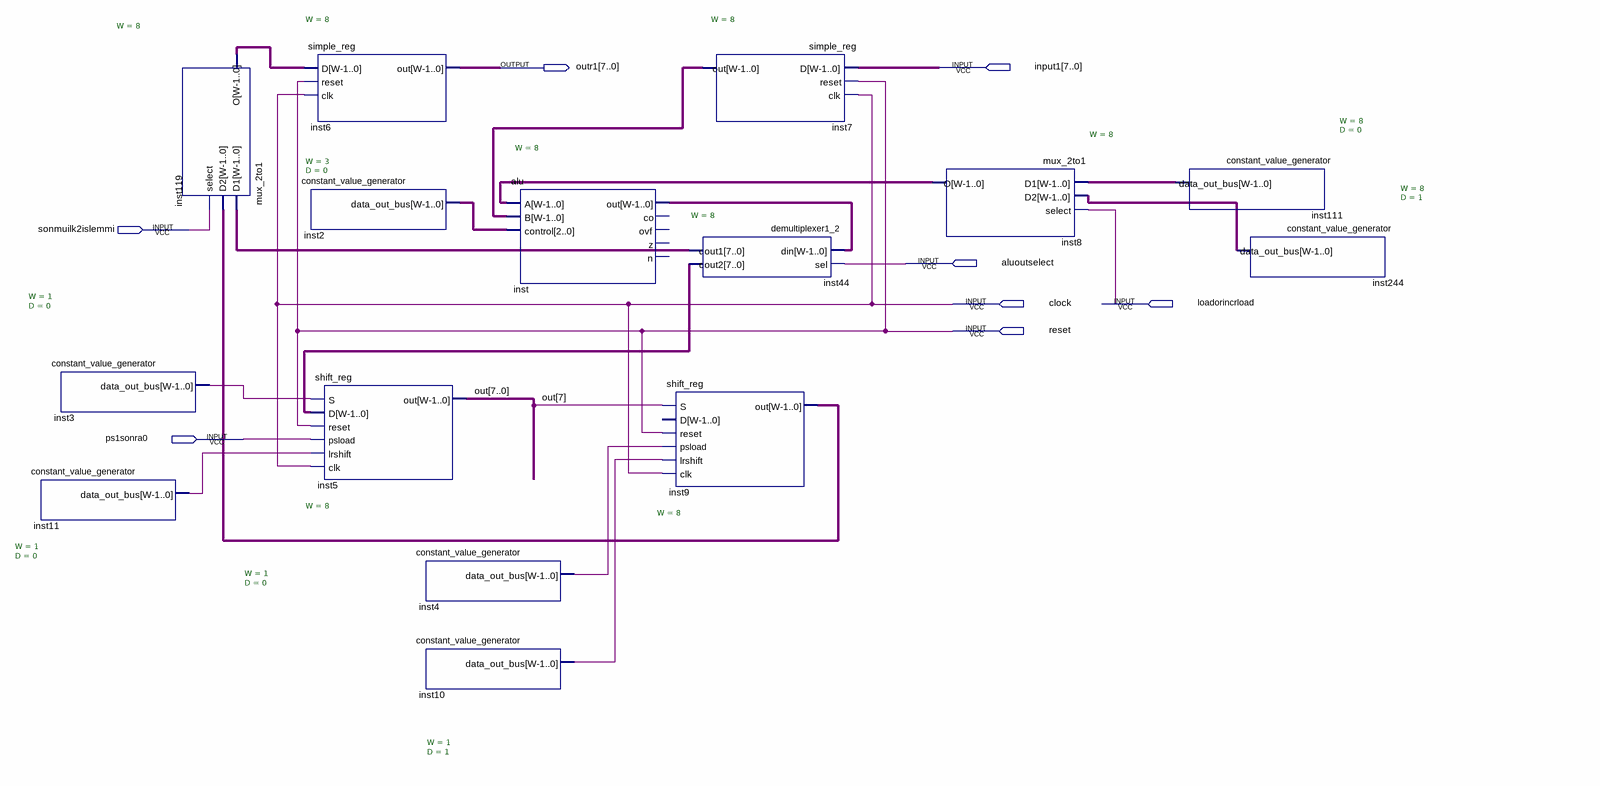
[diagram p0: schematic sheet]
// Quartus schematic datapath.bdf as structural Verilog: 15 symbols, 8 pins
module datapath (
  input  [7:0] input1,
  input  sonmuilk2islemmi,
  input  aluoutselect,
  input  clock,
  input  loadorincrload,
  input  reset,
  input  ps1sonra0,
  output [7:0] outr1
);

  wire inst3_data_out_bus, inst4_data_out_bus, inst10_data_out_bus, inst11_data_out_bus;
  wire [2:0] inst2_data_out_bus;
  wire [7:0] inst7_out, inst8_o, inst9_out, inst44_dout1, inst44_dout2, inst111_data_out_bus, inst119_o,
       inst244_data_out_bus, inst_out, out;

  constant_value_generator #(.W(1), .D(0)) inst11 (.data_out_bus(inst11_data_out_bus));
  constant_value_generator #(.W(1), .D(0)) inst3 (.data_out_bus(inst3_data_out_bus));
  mux_2to1 #(.W(8)) inst119 (.D1(inst44_dout1), .D2(inst9_out), .select(sonmuilk2islemmi), .O(inst119_o));
  simple_reg #(.W(8)) inst6 (.D(inst119_o), .reset(reset), .clk(clock), .out(outr1));
  constant_value_generator #(.W(3), .D(0)) inst2 (.data_out_bus(inst2_data_out_bus));
  shift_reg #(.W(8)) inst5 (
    .S(inst3_data_out_bus), .D(inst44_dout2), .reset(reset), .psload(ps1sonra0),
    .lrshift(inst11_data_out_bus), .clk(clock), .out(out));
  constant_value_generator #(.W(1), .D(0)) inst4 (.data_out_bus(inst4_data_out_bus));
  constant_value_generator #(.W(1), .D(1)) inst10 (.data_out_bus(inst10_data_out_bus));
  alu #(.W(8)) inst (.A(inst8_o), .B(inst7_out), .control(inst2_data_out_bus), .out(inst_out));  // open: co, ovf, z, n
  demultiplexer1_2 #(.W(8)) inst44 (.din(inst_out), .sel(aluoutselect), .dout1(inst44_dout1), .dout2(inst44_dout2));
  shift_reg #(.W(8)) inst9 (
    .S(out[7]), .reset(reset), .psload(inst4_data_out_bus), .lrshift(inst10_data_out_bus), .clk(clock),
    .out(inst9_out));  // open: D
  simple_reg #(.W(8)) inst7 (.D(input1), .reset(reset), .clk(clock), .out(inst7_out));
  mux_2to1 #(.W(8)) inst8 (.D1(inst111_data_out_bus), .D2(inst244_data_out_bus), .select(loadorincrload), .O(inst8_o));
  constant_value_generator #(.W(8), .D(0)) inst111 (.data_out_bus(inst111_data_out_bus));
  constant_value_generator #(.W(8), .D(1)) inst244 (.data_out_bus(inst244_data_out_bus));
endmodule
